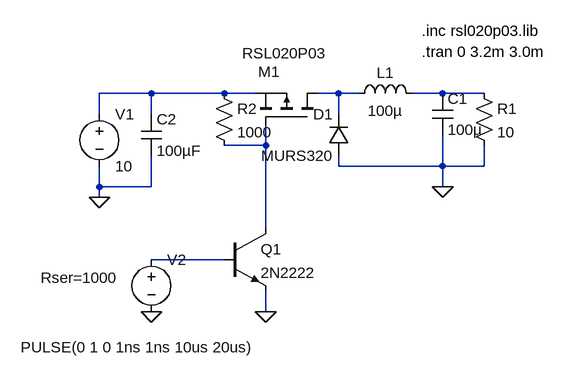
[diagram p0: schematic buck_basic.asc]
buck_basic.asc, the LTspice schematic file:
Version 4
SHEET 1 1368 680
WIRE 48 128 -32 128
WIRE 160 128 48 128
WIRE 208 128 160 128
WIRE 336 128 304 128
WIRE 368 128 336 128
WIRE 496 128 448 128
WIRE 560 128 496 128
WIRE -32 160 -32 128
WIRE 48 160 48 128
WIRE 336 160 336 128
WIRE 224 208 224 176
WIRE 224 208 160 208
WIRE 336 240 336 224
WIRE 496 240 496 192
WIRE 496 240 336 240
WIRE 560 240 560 208
WIRE 560 240 496 240
WIRE -32 272 -32 240
WIRE 48 272 48 224
WIRE 48 272 -32 272
WIRE 496 272 496 240
WIRE -32 288 -32 272
WIRE 224 336 224 208
WIRE 160 384 48 384
WIRE 224 464 224 432
FLAG 48 464 0
FLAG 224 464 0
FLAG 496 272 0
FLAG -32 288 0
SYMBOL voltage -32 144 R0
WINDOW 123 0 0 Left 0
WINDOW 39 0 0 Left 0
SYMATTR InstName V1
SYMATTR Value 10
SYMBOL voltage 48 368 R0
WINDOW 3 -201 151 Left 2
WINDOW 123 0 0 Left 0
WINDOW 39 -170 44 Left 2
SYMATTR Value PULSE(0 1 0 1ns 1ns 10us 20us)
SYMATTR SpiceLine Rser=1000
SYMATTR InstName V2
SYMBOL pmos 304 176 M270
WINDOW 0 81 92 VLeft 2
WINDOW 3 110 116 VLeft 2
SYMATTR InstName M1
SYMATTR Value RSL020P03
SYMBOL diode 352 224 R180
WINDOW 0 24 64 Left 2
WINDOW 3 24 0 Left 2
SYMATTR InstName D1
SYMATTR Value MURS320
SYMBOL npn 160 336 R0
SYMATTR InstName Q1
SYMATTR Value 2N2222
SYMBOL ind 352 144 R270
WINDOW 0 32 56 VTop 2
WINDOW 3 5 56 VBottom 2
SYMATTR InstName L1
SYMATTR Value 100µ
SYMBOL cap 480 128 R0
SYMATTR InstName C1
SYMATTR Value 100µ
SYMBOL cap 32 160 R0
SYMATTR InstName C2
SYMATTR Value 100µF
SYMBOL res 544 112 R0
SYMATTR InstName R1
SYMATTR Value 10
SYMBOL res 144 112 R0
SYMATTR InstName R2
SYMATTR Value 1000
TEXT 464 32 Left 2 !.inc rsl020p03.lib
TEXT 464 64 Left 2 !.tran 0 3.2m 3.0m

The netlist it stands for:
* buck_basic.asc
V1 N001 0 10
V2 N005 0 PULSE(0 1 0 1ns 1ns 10us 20us) Rser=1000
M1 N002 N004 N001 N001 RSL020P03
D1 0 N002 MURS320
Q1 N004 N005 0 0 2N2222
L1 N002 N003 100µ
C1 N003 0 100µ
C2 N001 0 100µF
R1 N003 0 10
R2 N001 N004 1000
.model D D
.lib standard.dio
.model NPN NPN
.model PNP PNP
.lib standard.bjt
.model NMOS NMOS
.model PMOS PMOS
.lib standard.mos
.inc rsl020p03.lib
.tran 0 3.2m 3.0m
.backanno
.end